# EAGLE design RFID (EAGLE 7.1.0)
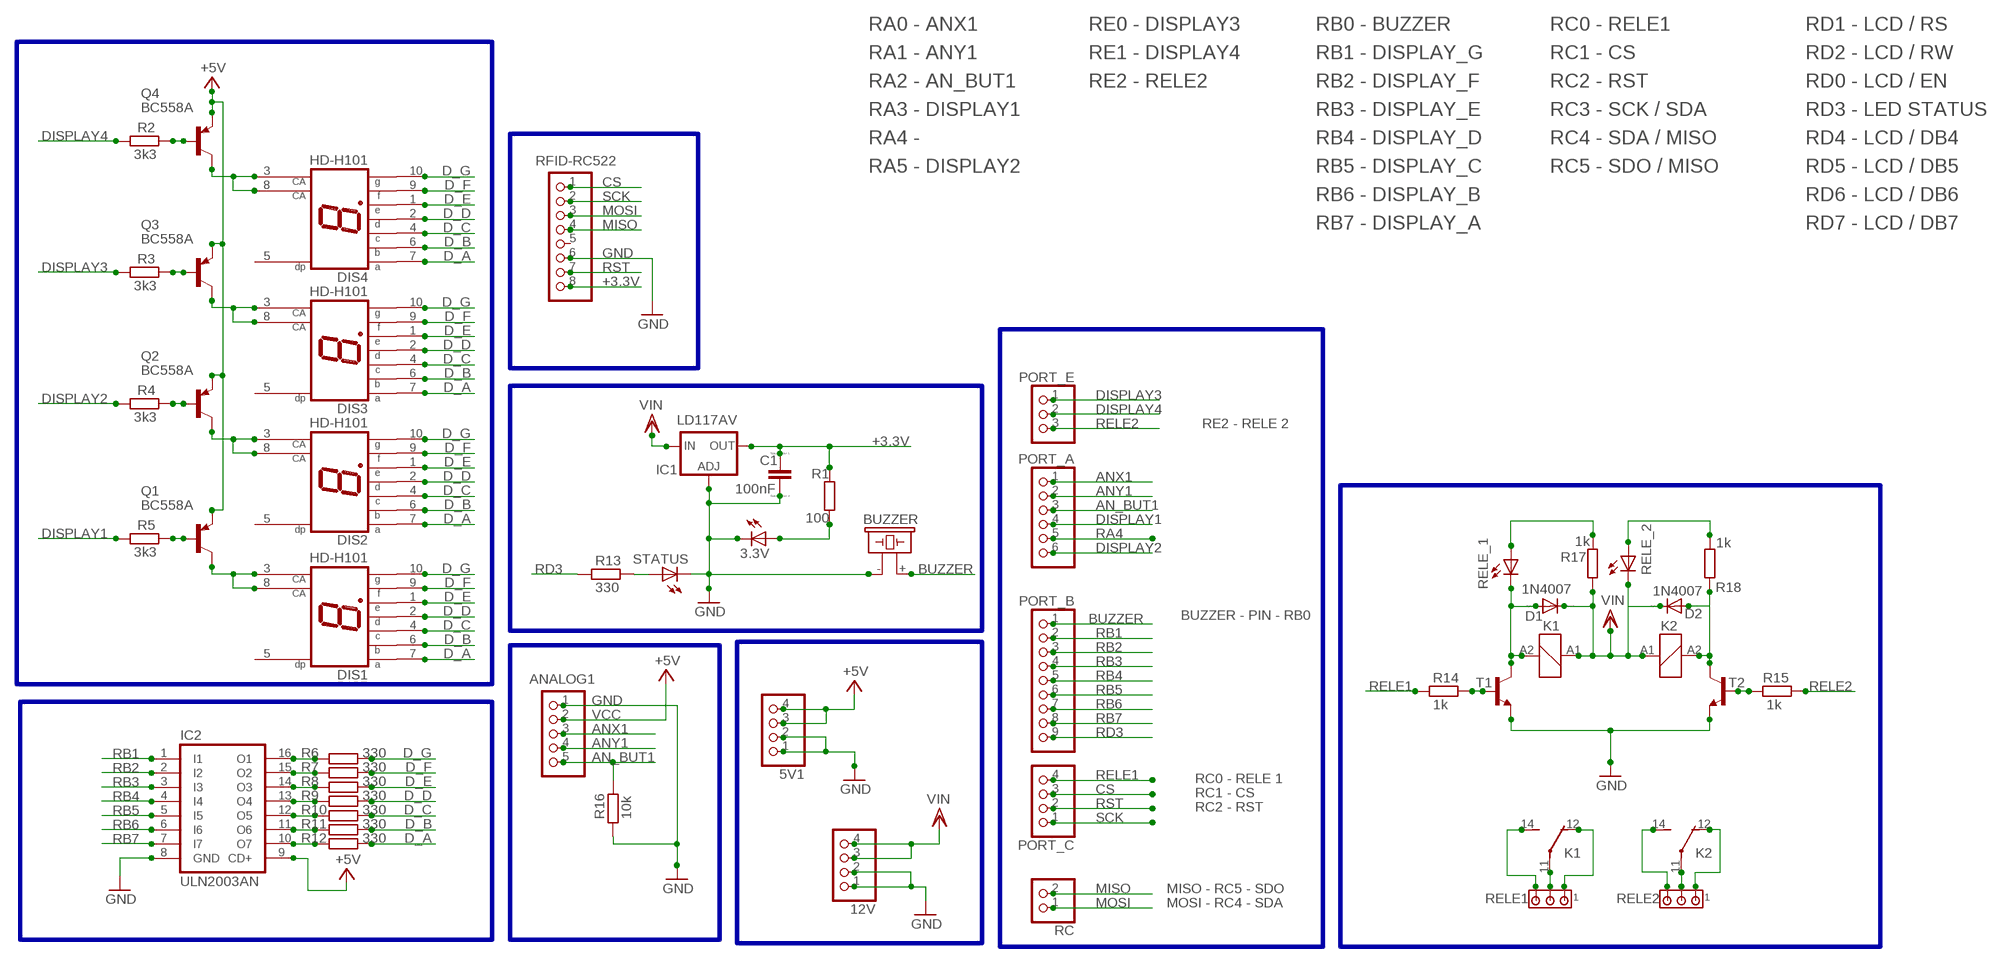
[diagram p0: schematic, sheet 1]

## Parts
3.3V  LED5MM  [LED5MM]
5V  BUZZER  F/CM12P  [F/CM12P]
5V1  PINHD-1X4  [1X04]
12V  PINHD-1X4  [1X04]
ANALOG1  PINHD-1X5  [1X05]
C1  100nF  C-EU050-025X075  [C050-025X075]
D1  1N4007  1N4004  [DO41-10]
D2  1N4007  1N4004  [DO41-10]
DIS1  HD-H101  [HDSP-M]
DIS2  HD-H101  [HDSP-M]
DIS3  HD-H101  [HDSP-M]
DIS4  HD-H101  [HDSP-M]
IC1  LD117AV  [TO220L1]
IC2  ULN2003AN  [DIL16]
JP1  RFID-RC522  PINHD-1X8  [1X08]
K1  ZNS5106  [ZN5]
K2  ZNS5106  [ZN5]
PORT_A  PINHD-1X6  [1X06]
PORT_B  PINHD-1X9  [1X09]
PORT_C  PINHD-1X4  [1X04]
PORT_E  PINHD-1X3  [1X03]
Q1  BC558A  [TO92-EBC]
Q2  BC558A  [TO92-EBC]
Q3  BC558A  [TO92-EBC]
Q4  BC558A  [TO92-EBC]
R1  100  R-EU_0207/10  [0207/10]
R2  3k3  R-EU_0207/10  [0207/10]
R3  3k3  R-EU_0207/10  [0207/10]
R4  3k3  R-EU_0207/10  [0207/10]
R5  3k3  R-EU_0207/10  [0207/10]
R6  330  R-EU_0207/10  [0207/10]
R7  330  R-EU_0207/10  [0207/10]
R8  330  R-EU_0207/10  [0207/10]
R9  330  R-EU_0207/10  [0207/10]
R10  330  R-EU_0207/10  [0207/10]
R11  330  R-EU_0207/10  [0207/10]
R12  330  R-EU_0207/10  [0207/10]
R13  330  R-EU_0207/10  [0207/10]
R14  1k  R-EU_0207/10  [0207/10]
R15  1k  R-EU_0207/10  [0207/10]
R16  10k  R-EU_0207/10  [0207/10]
R17  1k  R-EU_0207/10  [0207/10]
R18  1k  R-EU_0207/10  [0207/10]
RC  PINHD-1X2  [1X02]
RELE1  MTA03-156  [1X3MTA]
RELE2  MTA03-156  [1X3MTA]
RELE_1  LED5MM  [LED5MM]
RELE_2  LED5MM  [LED5MM]
STATUS  LED5MM  [LED5MM]
T1  BC548-NPN-TO92-CBE  [TO92-CBE]
T2  BC548-NPN-TO92-CBE  [TO92-CBE]

## Nets
+3.3V: C1.1 IC1.2(OUT) JP1.8 R1.2
AN_BUT1: ANALOG1.5 PORT_A.3 R16.1
ANX1: ANALOG1.3 PORT_A.1
ANY1: ANALOG1.4 PORT_A.2
BUZZER: 5V.+ PORT_B.1
CS: JP1.1 PORT_C.3
D_A: DIS1.7(A) DIS2.7(A) DIS3.7(A) DIS4.7(A) R12.1
D_B: DIS1.6(B) DIS2.6(B) DIS3.6(B) DIS4.6(B) R11.1
D_C: DIS1.4(C) DIS2.4(C) DIS3.4(C) DIS4.4(C) R10.1
D_D: DIS1.2(D) DIS2.2(D) DIS3.2(D) DIS4.2(D) R9.1
D_E: DIS1.1(E) DIS2.1(E) DIS3.1(E) DIS4.1(E) R8.1
D_F: DIS1.9(F) DIS2.9(F) DIS3.9(F) DIS4.9(F) R7.1
D_G: DIS1.10(G) DIS2.10(G) DIS3.10(G) DIS4.10(G) R6.1
DISPLAY1: PORT_A.4 R5.2
DISPLAY2: PORT_A.6 R4.2
DISPLAY3: PORT_E.1 R3.2
DISPLAY4: PORT_E.2 R2.2
GND: 3.3V.K(C) 5V1.1 5V1.2 5V.- 12V.1 12V.2 ANALOG1.1 C1.2 IC1.1(ADJ) IC2.8(GND) JP1.6 R16.2 STATUS.K(C) T1.E T2.E
MISO: JP1.4 RC.2
MOSI: JP1.3 RC.1
N$1: 3.3V.A R1.1
N$2: DIS4.3(CA) DIS4.8(CA) Q4.C
N$3: Q1.B R5.1
N$4: Q2.B R4.1
N$5: Q3.B R3.1
N$6: Q4.B R2.1
N$7: IC2.16(O1) R6.2
N$8: IC2.15(O2) R7.2
N$9: IC2.14(O3) R8.2
N$10: IC2.13(O4) R9.2
N$11: IC2.12(O5) R10.2
N$12: IC2.11(O6) R11.2
N$13: IC2.10(O7) R12.2
N$14: D2.A K2.A2 R18.2 T2.C
N$15: R13.1 STATUS.A
N$16: D1.A K1.A2 RELE_1.K(C) T1.C
N$17: R14.1 T1.B
N$18: K1.11(2:P) RELE1.2
N$19: R15.2 T2.B
N$20: K1.12(2:O) RELE1.1
N$21: K1.14(2:S) RELE1.3
N$22: K2.11(2:P) RELE2.2
N$23: K2.14(2:S) RELE2.3
N$24: K2.12(2:O) RELE2.1
N$25: R17.2 RELE_1.A
N$26: R18.1 RELE_2.A
RA4: PORT_A.5
RB1: IC2.1(I1) PORT_B.2
RB2: IC2.2(I2) PORT_B.3
RB3: IC2.3(I3) PORT_B.4
RB4: IC2.4(I4) PORT_B.5
RB5: IC2.5(I5) PORT_B.6
RB6: IC2.6(I6) PORT_B.7
RB7: IC2.7(I7) PORT_B.8
RD3: PORT_B.9 R13.2
RELE1: PORT_C.4 R14.2
RELE2: PORT_E.3 R15.1
RST: JP1.7 PORT_C.2
SCK: JP1.2 PORT_C.1
VCC: 5V1.3 5V1.4 ANALOG1.2 IC2.9(CD+) Q1.E Q2.E Q3.E Q4.E ; supply symbol labelled +5V
VCC1: DIS3.3(CA) DIS3.8(CA) Q3.C
VCC2: DIS2.3(CA) DIS2.8(CA) Q2.C
VCC3: DIS1.3(CA) DIS1.8(CA) Q1.C
VDD: 12V.3 12V.4 D1.C D2.C IC1.3(IN) K1.A1 K2.A1 R17.1 RELE_2.K(C) ; supply symbol labelled VIN
Unconnected: DIS1.5(DP) DIS2.5(DP) DIS3.5(DP) DIS4.5(DP) JP1.5

## Buses
B$1
B$2
B$3
B$4
B$5
B$6
B$7
B$8

## Notes on the sheet
- RA0 - ANX1 | RE0 - DISPLAY3 | RB0 - BUZZER | RC0 - RELE1 | RD1 - LCD / RS
- RA1 - ANY1 | RE1 - DISPLAY4 | RB1 - DISPLAY_G | RC1 - CS | RD2 - LCD / RW
- RA2 - AN_BUT1 | RE2 - RELE2 | RB2 - DISPLAY_F | RC2 - RST | RD0 - LCD / EN
- RA3 - DISPLAY1 | RB3 - DISPLAY_E | RC3 - SCK / SDA | RD3 - LED STATUS
- RA4 - | RB4 - DISPLAY_D | RC4 - SDA / MISO | RD4 - LCD / DB4
- RA5 - DISPLAY2 | RB5 - DISPLAY_C | RC5 - SDO / MISO | RD5 - LCD / DB5
- RB6 - DISPLAY_B | RD6 - LCD / DB6
- RB7 - DISPLAY_A | RD7 - LCD / DB7
- RE2 - RELE 2
- BUZZER - PIN - RB0
- RC0 - RELE 1
- RC1 - CS
- RC2 - RST
- MISO - RC5 - SDO
- MOSI - RC4 - SDA

## Library data of the parts
3.3V RELE_1 RELE_2 STATUS = led:LED: LED OSRAM: - CHIPLED LG R971, LG N971, LY N971, LG Q971, LY Q971, LO R971, LY R971 LH N974, LH R974 LS Q976, LO Q976, LY Q976 LO Q996 - Hyper CHIPLED LW Q18S LB Q993, LB Q99A, LB R99A - SideLED LS A670, LO A670, LY A670, LG A670, LP A670 LB A673, LV A673, LT A673, LW A673 LH A674 LY A675 LS A676, LA A676, LO A676, LY A676, LW A676 LS A679, LY A679, LG A679 - Hyper Micro SIDELED® LS Y876, LA Y876, LO Y876, LY Y876 LT Y87S - SmartLED LW L88C, LW L88S LB L89C, LB L89S, LG L890 LS L89K, LO L89K, LY L89K LS L896, LA L896, LO L896, LY L896 - TOPLED LS T670, LO T670, LY T670, LG T670, LP T670 LSG T670, LSP T670, LSY T670, LOP T670, LYG T670 LG T671, LOG T671, LSG T671 LB T673, LV T673, LT T673, LW T673 LH T674 LS T676, LA T676, LO T676, LY T676, LB T676, LH T676, LSB T676, LW T676 LB T67C, LV T67C, LT T67C, LS T67K, LO T67K, LY T67K, LW E67C LS E67B, LA E67B, LO E67B, LY E67B, LB E67C, LV E67C, LT E67C LW T67C LS T679, LY T679, LG T679 LS T770, LO T770, LY T770, LG T770, LP T770 LB T773, LV T773, LT T773, LW T773 LH T774 LS E675, LA E675, LY E675, LS T675 LS T776, LA T776, LO T776, LY T776, LB T776 LHGB T686 LT T68C, LB T68C - Hyper Mini TOPLED® LB M676 - Mini TOPLED Santana® LG M470 LS M47K, LO M47K, LY M47K Source: http://www.osram.convergy.de LUXEON: - LUMILED® LXK2-PW12-R00, LXK2-PW12-S00, LXK2-PW14-U00, LXK2-PW14-V00 LXK2-PM12-R00, LXK2-PM12-S00, LXK2-PM14-U00 LXK2-PE12-Q00, LXK2-PE12-R00, LXK2-PE12-S00, LXK2-PE14-T00, LXK2-PE14-U00 LXK2-PB12-K00, LXK2-PB12-L00, LXK2-PB12-M00, LXK2-PB14-N00, LXK2-PB14-P00, LXK2-PB14-Q00 LXK2-PR12-L00, LXK2-PR12-M00, LXK2-PR14-Q00, LXK2-PR14-R00 LXK2-PD12-Q00, LXK2-PD12-R00, LXK2-PD12-S00 LXK2-PH12-R00, LXK2-PH12-S00 LXK2-PL12-P00, LXK2-PL12-Q00, LXK2-PL12-R00 Source: www.luxeon.com KINGBRIGHT: KA-3528ASYC Source: www.kingbright.com
5V = buzzer:F/CM12P: BUZZER Source: Buerklin; OC_FARNELL: unknown; OC_NEWARK: unknown
5V1 12V PORT_C = pinhead:PINHD-1X4: PIN HEADER
ANALOG1 = pinhead:PINHD-1X5: PIN HEADER
C1 = resistor:C-EU: CAPACITOR, European symbol; SPICEPREFIX: C
D1 D2 = diode:1N4004: DIODE general purpose rectifier, 1 A
DIS1-DIS4 = display-hp:HD-H101: LED DISPLAY 1-character 7 segment, decimal point right; OC_FARNELL: unknown; OC_NEWARK: unknown
IC1 = v-reg:LD117A?*: Low drop fixed and adjustable positive voltage regulators 1 A Source: http://www.st.com/stonline/products/literature/ds/7194/ld1117axx.pdf
IC2 = uln-udn:ULN2003A: DRIVER ARRAY
JP1 = pinhead:PINHD-1X8: PIN HEADER
K1 K2 = relay:ZNS5*: Miniature Power PCB Relay SCHRACK 1pole 10 A Source: http://www.schrack.com/.. 5847.pdf; OC_FARNELL: unknown; OC_NEWARK: unknown
PORT_A = pinhead:PINHD-1X6: PIN HEADER
PORT_B = pinhead:PINHD-1X9: PIN HEADER
PORT_E = pinhead:PINHD-1X3: PIN HEADER
Q1-Q4 = transistor-pnp:BC558*: PNP Transistror
R1-R18 = rcl:R-EU_: RESISTOR, European symbol
RC = pinhead:PINHD-1X2: PIN HEADER
RELE1 RELE2 = con-amp:MTA03-156: AMP connector
T1 T2 = transistor:*-NPN-: NPN Transistror BF959 corrected 2008.03.06

## Board
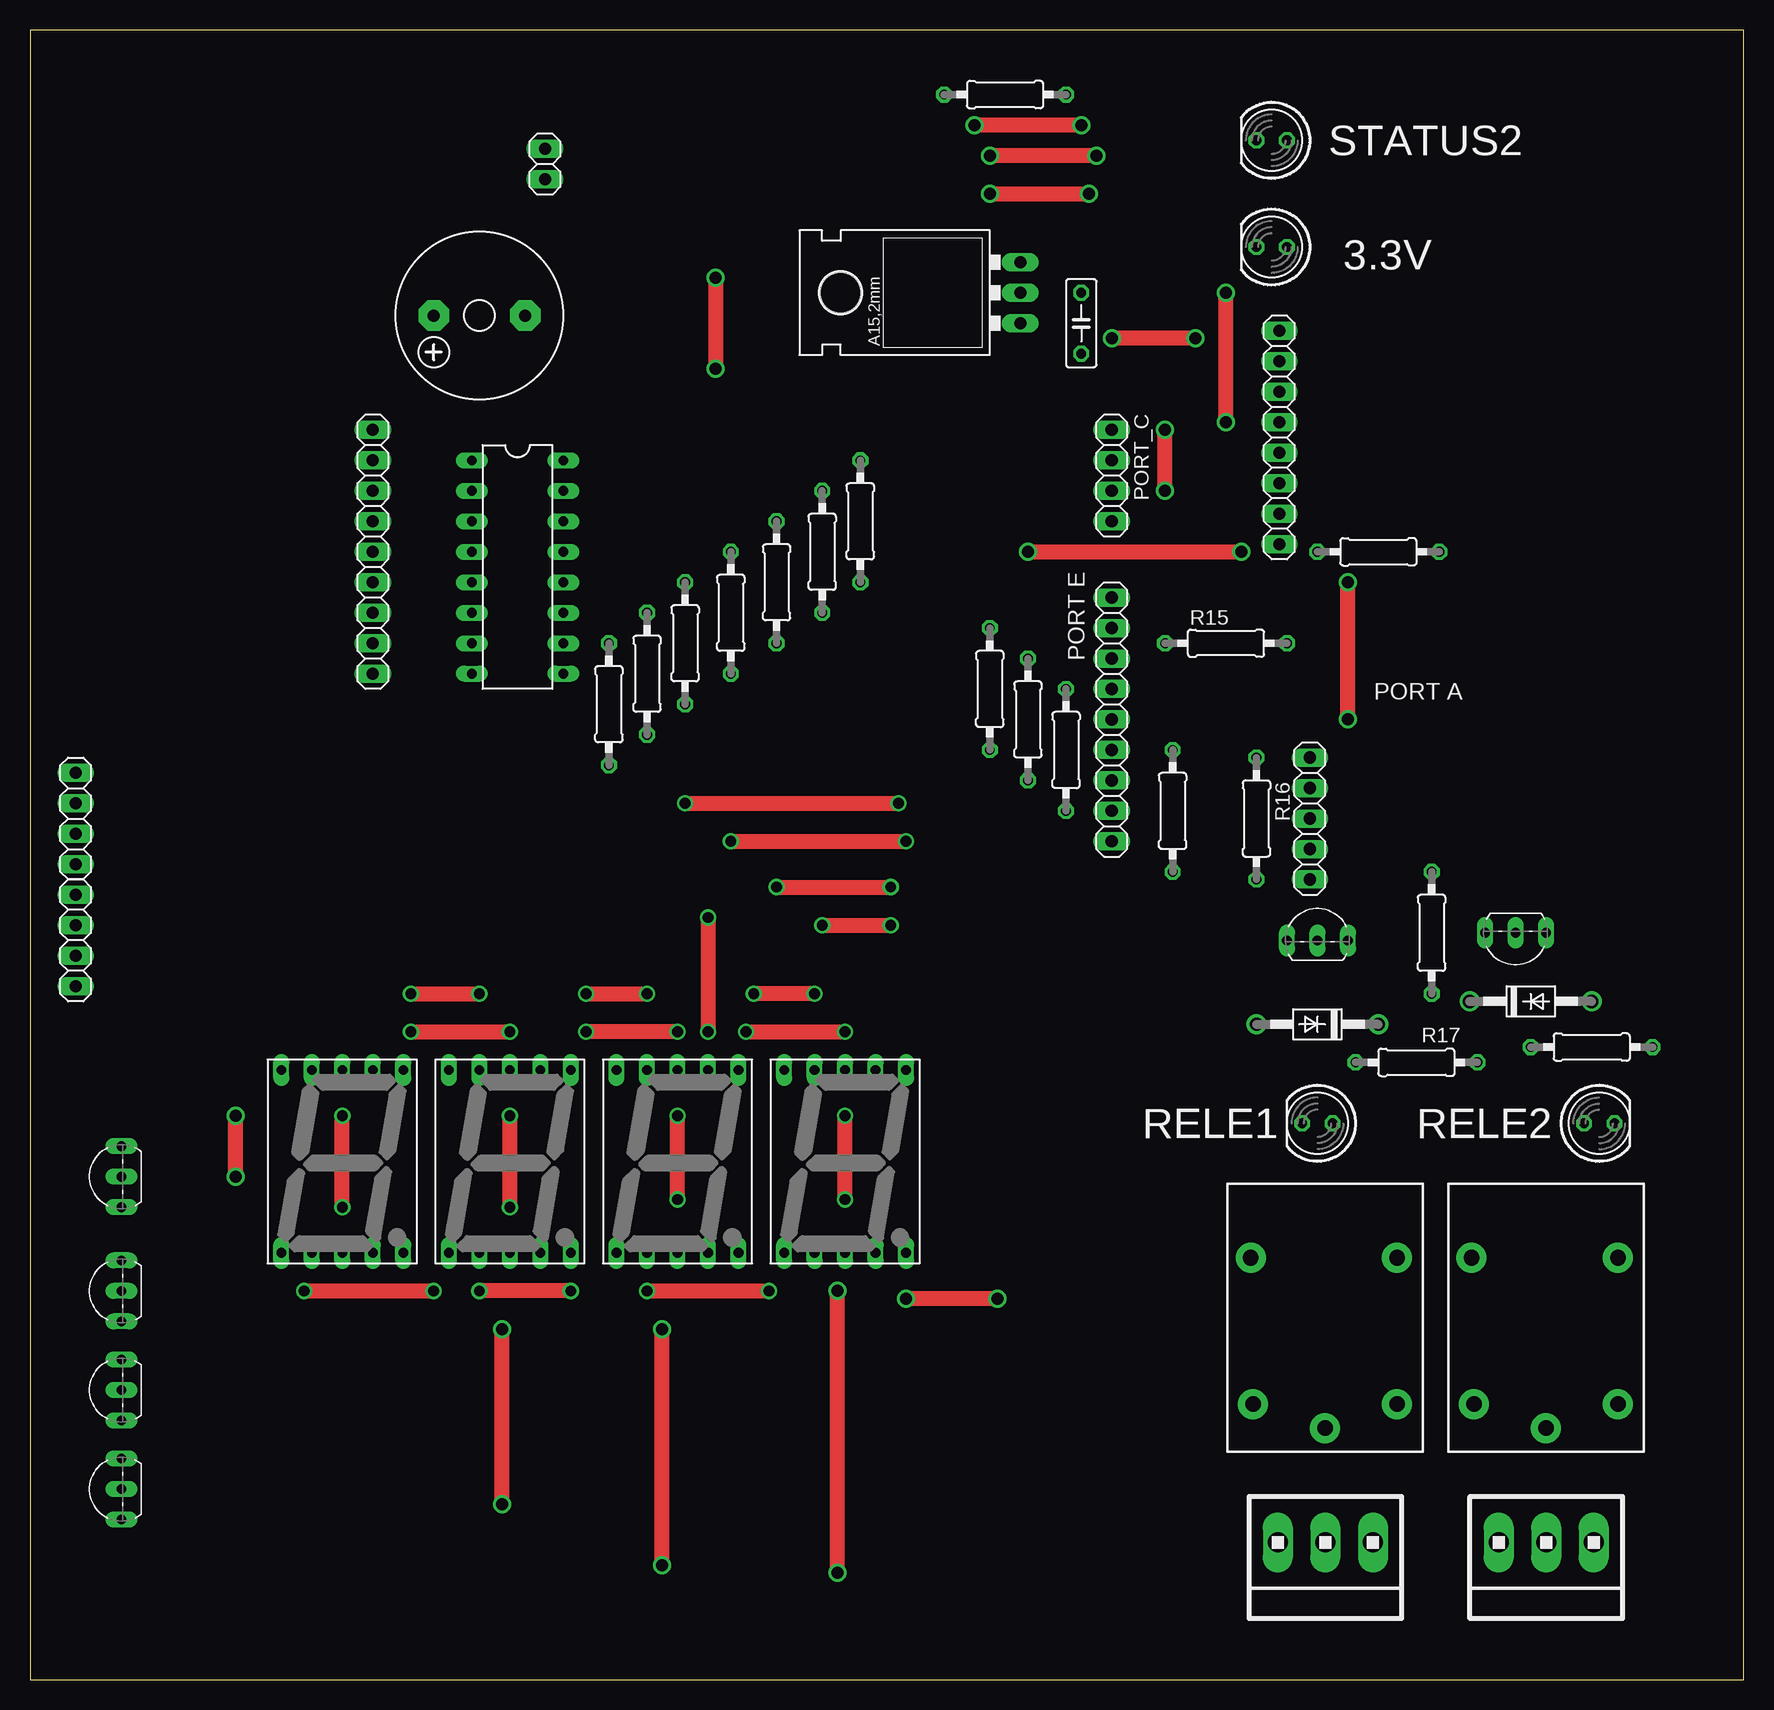
[diagram p1: board, top side]
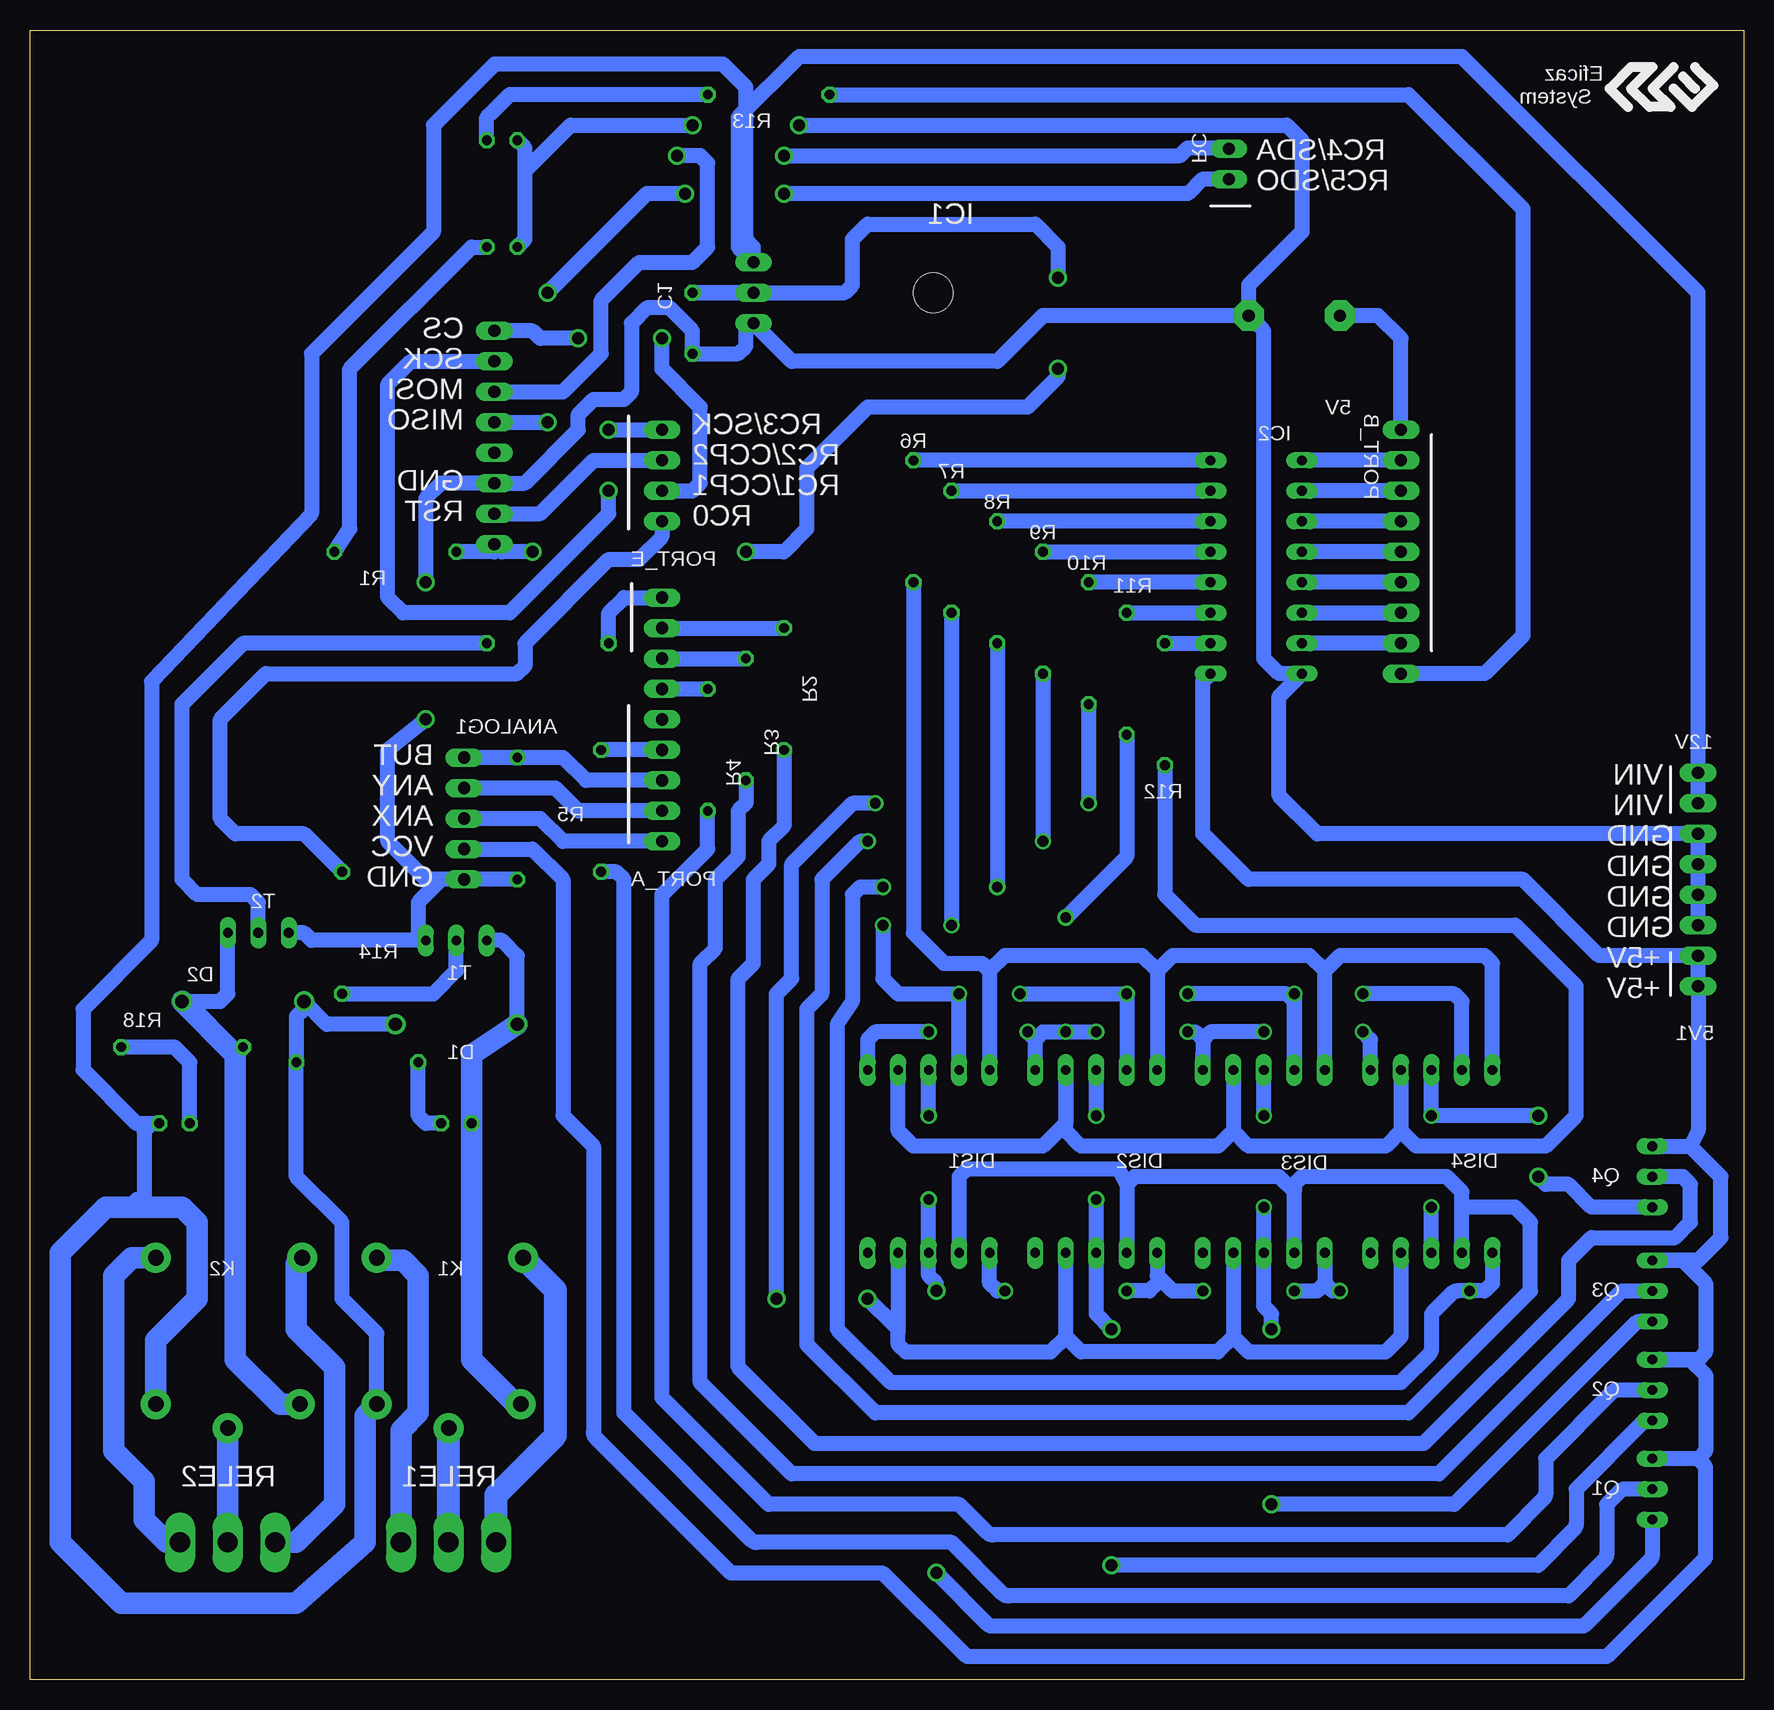
[diagram p2: board, bottom side, seen from below]

Size 142.85 x 137.47 mm. Coordinates in mm from the lower left corner, seen from the top.
Outline: 0,0 142.85,0 142.85,137.47 0,137.47 0,0
Copper layers (1*16): Top 0.035mm / dielectric 1.5mm / Bottom 0.035mm
Design rules "default": minimum track width 10mil, minimum drill 24mil, track to track 8mil, track to pad 8mil, pad to pad 8mil, via to via 8mil, smd to smd 8mil, copper to edge 40mil, drill to drill 8mil, minimum pad ring 10mil, minimum via ring 8mil, stop-mask expansion 4mil, vias tented up to drill 0mil, thermal gap 10mil

### Footprints (pad centres in the part's own frame; a part is rotated, then mirrored left to right if it is on the bottom)
LED5MM = drill 0.813 octagon: A -1.27,0; K 1.27,0
F/CM12P = drill 1.016 pad 2.54 octagon: + 3.81,0; - -3.81,0
1X04 = drill 1.016 long: 1 -3.81,0; 2 -1.27,0; 3 1.27,0; 4 3.81,0
1X05 = drill 1.016 long: 1 -5.08,0; 2 -2.54,0; 3 0,0; 4 2.54,0; 5 5.08,0
C050-025X075 = drill 0.813 octagon: 1 -2.54,0; 2 2.54,0
DO41-10 = drill 1.118: A 5.08,0; C -5.08,0
HDSP-M = drill 0.813 long: 1 -5.08,-7.62; 2 -2.54,-7.62; 3 0,-7.62; 4 2.54,-7.62; 5 5.08,-7.62; 6 5.08,7.62; 7 2.54,7.62; 8 0,7.62; 9 -2.54,7.62; 10 -5.08,7.62
TO220L1 = drill 1.016 long: 1 -2.54,-3.81; 2 0,-3.81; 3 2.54,-3.81 | hole 3.302: 0,11.176
DIL16 = drill 0.813 long: 1 -8.89,-3.81; 2 -6.35,-3.81; 3 -3.81,-3.81; 4 -1.27,-3.81; 5 1.27,-3.81; 6 3.81,-3.81; 7 6.35,-3.81; 8 8.89,-3.81; 9 8.89,3.81; 10 6.35,3.81; 11 3.81,3.81; 12 1.27,3.81; 13 -1.27,3.81; 14 -3.81,3.81; 15 -6.35,3.81; 16 -8.89,3.81
1X08 = drill 1.016 long: 1 -8.89,0; 2 -6.35,0; 3 -3.81,0; 4 -1.27,0; 5 1.27,0; 6 3.81,0; 7 6.35,0; 8 8.89,0
ZN5 = drill 1.3 pad 2.5: 11 8.89,0; 12 -5.31,-6.2; 14 -5.31,6; A1 6.89,6; A2 6.89,-6
1X06 = drill 1.016 long: 1 -6.35,0; 2 -3.81,0; 3 -1.27,0; 4 1.27,0; 5 3.81,0; 6 6.35,0
1X09 = drill 1.016 long: 1 -10.16,0; 2 -7.62,0; 3 -5.08,0; 4 -2.54,0; 5 0,0; 6 2.54,0; 7 5.08,0; 8 7.62,0; 9 10.16,0
1X03 = drill 1.016 long: 1 -2.54,0; 2 0,0; 3 2.54,0
TO92-EBC = drill 0.813 long: B 0,-1.27; C -2.54,-1.27; E 2.54,-1.27
0207/10 = drill 0.813 octagon: 1 -5.08,0; 2 5.08,0
1X02 = drill 1.016 long: 1 -1.27,0; 2 1.27,0
1X3MTA = drill 1.676 long: 1 3.937,0; 2 -0.025,0; 3 -3.988,0
TO92-CBE = drill 0.813 long: B 0,0; C -2.54,0; E 2.54,0

### Placement (x,y rotation side)
3.3V  103.5,119.38 180 top
5V  37.47,113.67 180 top
5V1  3.81,61.59 270 top
12V  3.81,71.75 90 top
ANALOG1  106.68,71.75 90 top
C1  87.63,113.03 270 top
D1  107.31,54.61 180 top
D2  125.09,56.52 0 top
DIS1  67.94,43.18 0 top
DIS2  53.98,43.18 0 top
DIS3  40.01,43.18 0 top
DIS4  26.04,43.18 0 top
IC1  78.74,115.57 90 top
IC2  40.64,92.71 270 top
JP1  104.14,103.51 270 top
K1  107.95,29.85 270 top
K2  126.36,29.85 270 top
PORT_A  90.17,76.2 90 top
PORT_B  28.57,93.98 270 top
PORT_C  90.17,100.33 270 top
PORT_E  90.17,87.63 90 top
Q1  6.35,15.88 90 top
Q2  6.35,24.13 90 top
Q3  6.35,32.39 90 top
Q4  6.35,41.91 90 top
R1  112.39,93.98 180 top
R2  80.01,82.55 90 top
R3  83.19,80.01 90 top
R4  86.36,77.47 90 top
R5  95.25,72.39 90 top
R6  69.22,96.52 90 top
R7  66.04,93.98 90 top
R8  62.23,91.44 90 top
R9  58.42,88.9 90 top
R10  54.61,86.36 90 top
R11  51.44,83.82 90 top
R12  48.26,81.28 90 top
R13  81.28,132.08 180 top
R14  116.84,62.23 90 top
R15  99.69,86.36 0 top
R16  102.23,71.75 270 top
R17  115.57,51.44 180 top
R18  130.18,52.71 180 top
RC  42.93,126.29 270 top
RELE1  107.95,11.43 180 top
RELE2  126.36,11.43 180 top
RELE_1  107.31,46.36 180 top
RELE_2  130.81,46.36 0 top
STATUS  103.5,128.27 180 top
T1  107.31,61.59 0 top
T2  123.83,62.23 180 top

### Tracks (layer width: path | path; a pad name or v marks a point on that pad's centre or on a via)
+3.3V  (via drill 1)
  Top 1.27: v57.15,116.84 v57.15,109.22 | v83.19,93.98 v100.97,93.98
  Bottom 1.27: IC1.2 C1.1 74.93,115.57 74.3,116.2 74.3,120.02 73.03,121.28 59.05,121.28 57.15,119.38 v57.15,116.84 | v57.15,109.22 57.15,108.59 59.69,106.05 73.03,106.05 78.11,100.97 78.11,95.89 80.01,93.98 v83.19,93.98 | v100.97,93.98 103.5,93.98 JP1.8 104.14,93.98 R1.2
AN_BUT1
  Bottom 1.27: PORT_A.3 96.52,74.93 98.42,76.84 ANALOG1.5 R16.1
ANX1
  Bottom 1.27: PORT_A.1 98.42,69.85 100.33,71.75 ANALOG1.3
ANY1
  Bottom 1.27: PORT_A.2 97.16,72.39 99.06,74.3 ANALOG1.4
BUZZER
  Bottom 1.27: PORT_B.1 28.57,111.76 30.48,113.67 5V.+
CS  (via drill 1)
  Top 1.27: v97.16,111.76 v90.17,111.76
  Bottom 1.27: v97.16,111.76 100.33,111.76 100.97,112.4 JP1.1 104.78,112.4 | PORT_C.3 87.63,99.06 87,99.69 87,106.05 90.17,109.22 v90.17,111.76
D_A
  Bottom 1.27: DIS4.7 28.57,45.72 | 28.57,45.72 29.84,44.45 41.27,44.45 42.55,45.72 | DIS3.7 42.55,45.72 | 42.55,45.72 43.81,44.45 55.24,44.45 56.52,45.72 DIS2.7 56.52,46.36 58.42,44.45 69.22,44.45 70.48,45.72 DIS1.7 | R12.1 48.26,65.41 45.72,62.87 19.05,62.87 13.97,57.79 13.97,46.99 16.51,44.45 27.3,44.45 28.57,45.72
D_B  (via drill 0.9)
  Top 1.27: v31.75,53.98 v40.01,53.98 | v53.98,53.98 v46.35,53.98 | v59.69,53.98 v67.94,53.98 | v56.52,63.5 v56.52,53.98
  Bottom 1.27: 45.09,52.07 DIS3.6 45.09,53.34 | DIS4.6 31.11,53.34 v31.75,53.98 | v40.01,53.98 44.45,53.98 45.09,53.34 | DIS2.6 59.05,53.34 | v53.98,53.98 v56.52,53.98 58.42,53.98 59.05,53.34 | v46.35,53.98 45.72,53.98 45.09,53.34 | 59.05,53.34 v59.69,53.98 | v67.94,53.98 72.39,53.98 73.03,53.34 DIS1.6 | R11.1 51.44,68.58 v56.52,63.5
D_C  (via drill 0.9, 1)
  Top 1.27: v54.61,73.03 v72.39,73.03 | v80.64,31.75 v73.03,31.75
  Bottom 1.27: DIS4.4 28.57,28.58 29.84,27.31 41.27,27.31 42.55,28.58 | DIS3.4 42.55,28.58 | 42.55,28.58 43.81,27.31 55.24,27.31 56.52,28.58 | 56.52,28.58 DIS2.4 | DIS1.4 70.48,28.95 | 56.52,28.58 57.78,27.31 69.85,27.31 70.48,27.94 70.48,28.95 | R10.1 v54.61,73.03 | v72.39,73.03 74.3,73.03 79.38,67.95 79.38,58.42 80.64,57.15 v80.64,31.75 | 70.48,28.95 arc-45 70.67,29.4 v73.03,31.75
D_D  (via drill 0.9)
  Top 1.27: v58.42,69.85 v73.03,69.85
  Bottom 1.27: DIS4.2 23.5,39.37 | 23.5,39.37 23.5,40.64 24.77,41.91 36.83,41.91 37.47,41.28 37.47,40.64 | DIS3.2 37.47,40.64 | 37.47,40.64 38.73,41.91 50.8,41.91 51.44,41.28 | 51.44,41.28 DIS2.2 | 51.44,41.28 52.07,42.55 64.77,42.55 65.41,41.91 DIS1.2 | R9.1 v58.42,69.85 | v73.03,69.85 73.66,69.85 76.83,66.68 76.83,57.15 78.11,55.88 78.11,27.94 72.39,22.23 27.94,22.23 17.78,32.39 17.78,38.1 19.05,39.37 23.5,39.37
D_E  (via drill 0.9)
  Top 1.27: v22.86,32.39 v33.66,32.39 | v45.09,32.39 v37.47,32.39 | v51.44,32.39 v61.59,32.39 | v62.23,66.04 v71.75,66.04
  Bottom 1.27: DIS4.1 20.95,33.02 21.59,32.39 v22.86,32.39 23.87,32.39 arc-45 24.32,32.2 26.04,30.48 26.04,27.57 arc45 26.22,27.12 28.57,24.77 71.12,24.77 75.56,29.21 75.56,54.61 74.3,56.52 74.3,65.41 73.66,66.04 v71.75,66.04 | v33.66,32.39 34.29,32.39 34.92,33.02 | DIS3.1 34.92,33.02 | 34.92,33.02 35.56,32.39 v37.47,32.39 | v45.09,32.39 47.62,32.39 48.9,33.66 DIS2.1 48.9,33.02 49.53,32.39 v51.44,32.39 | v61.59,32.39 62.23,32.39 62.87,33.02 DIS1.1 | R8.1 v62.23,66.04
D_F  (via drill 0.9)
  Top 1.27: v31.75,57.15 v37.47,57.15 | v46.35,57.15 v51.44,57.15 | v65.41,57.15 v60.33,57.15 | v66.04,62.87 v71.75,62.87
  Bottom 1.27: DIS4.9 23.5,56.52 24.13,57.15 v31.75,57.15 | v37.47,57.15 DIS3.9 37.47,56.52 38.1,57.15 v46.35,57.15 | DIS2.9 v51.44,57.15 v60.33,57.15 | DIS1.9 v65.41,57.15 70.48,57.15 71.75,58.42 v71.75,62.87 | R7.1 v66.04,62.87
D_G
  Bottom 1.27: DIS4.10 20.95,59.69 21.59,60.33 33.66,60.33 34.92,59.06 | DIS3.10 34.92,59.06 | 34.92,59.06 36.2,60.33 47.62,60.33 48.9,59.06 | 48.9,59.06 DIS2.10 | 48.9,59.06 50.16,60.33 61.59,60.33 62.87,59.06 | 62.87,59.06 DIS1.10 | R6.1 69.22,62.23 66.67,59.69 63.5,59.69 62.87,59.06
DISPLAY1
  Bottom 1.27: PORT_A.4 R5.2
DISPLAY2
  Bottom 1.27: PORT_A.6 R4.2
DISPLAY3
  Bottom 1.27: PORT_E.1 R3.2
DISPLAY4
  Bottom 1.27: PORT_E.2 R2.2
GND  (via drill 1)
  Top 1.27: v87.63,129.54 v78.74,129.54 | v109.86,80.01 v109.86,91.44
  Bottom 1.27: 5V.- 40.01,112.4 40.01,85.09 38.73,83.82 IC2.8 38.73,81.92 38.73,73.66 35.56,70.49 12V.2 12V.1 5V1.1 5V1.2 | R16.2 ANALOG1.1 | ANALOG1.1 108.58,66.68 110.49,64.77 110.49,62.23 T1.E 119.38,61.59 120.02,62.23 T2.E | 3.3V.K 101.6,120.02 101.6,125.73 | 101.6,125.73 101.6,127.64 STATUS.K | 5V.- 58.42,113.67 62.23,109.86 79.38,109.86 IC1.1 83.19,112.4 83.19,111.12 83.82,110.49 C1.2 87.63,112.4 89.53,114.3 91.44,114.3 92.71,113.03 92.71,107.31 93.34,106.68 95.89,106.68 97.16,105.41 97.16,104.14 101.6,99.69 JP1.6 108.58,99.69 109.86,98.43 v109.86,91.44 | 101.6,125.73 97.79,129.54 v87.63,129.54 | v78.74,129.54 38.1,129.54 36.83,128.27 36.83,120.65 41.27,116.2 5V.- | ANALOG1.1 109.86,66.68 113.03,69.85 113.03,77.47 v109.86,80.01
MISO  (via drill 1)
  Top 1.27: v80.01,123.83 v88.27,123.83 | v99.69,104.78 v99.69,115.57
  Bottom 1.27: RC.2 45.16,125.02 46.35,123.83 v80.01,123.83 | v88.27,123.83 91.44,123.83 v99.69,115.57 | JP1.4 v99.69,104.78
MOSI  (via drill 1)
  Top 1.27: v88.9,127 v80.01,127
  Bottom 1.27: JP1.3 98.42,107.31 95.25,110.49 95.25,114.94 92.08,118.11 87.63,118.11 86.36,119.38 86.36,126.37 87,127 v88.9,127 | v80.01,127 46.99,127 46.35,127.64 43,127.64 RC.1
N$1
  Bottom 1.27: 3.3V.A 106.05,119.38 116.2,109.22 116.2,95.89 R1.1
N$2  (via drill 0.9, 1)
  Top 1.27: v26.04,39.37 v26.04,46.99 | v17.14,41.91 v17.14,46.99
  Bottom 1.27: DIS4.3 v26.04,39.37 | DIS4.8 v26.04,46.99 v17.14,46.99 | Q4.C 12.7,39.37 14.61,41.28 16.51,41.28 v17.14,41.91
N$3
  Bottom 1.27: R5.1 93.98,67.31 93.34,66.68 93.34,22.23 82.74,11.62 arc-45 82.29,11.43 66.04,11.43 61.78,7.17 arc-45 61.33,6.99 14.61,6.99 11.62,9.97 arc-45 11.43,10.42 11.43,14.61 10.35,15.69 arc45 9.9,15.88 Q1.B
N$4
  Bottom 1.27: R4.1 86.36,69.22 90.17,65.41 90.17,23.5 81.28,14.61 65.41,14.61 63.05,12.25 arc-45 62.6,12.07 19.68,12.07 16.7,15.05 arc-45 16.51,15.5 16.51,18.42 10.98,23.94 arc45 10.53,24.13 Q2.B
N$5
  Bottom 1.27: R3.1 83.19,73.03 83.82,72.39 83.82,68.58 85.72,66.68 85.72,60.96 87,59.69 87,24.77 79.38,17.15 25.4,17.15 10.16,32.39 Q3.B
N$6
  Bottom 1.27: R2.1 80.01,71.12 81.28,69.85 81.28,67.95 82.55,66.68 82.55,59.69 83.82,58.42 83.82,26.04 77.47,19.69 26.67,19.69 14.61,31.75 14.61,34.93 12.7,36.83 5.71,36.83 4.45,38.1 4.45,41.28 5.08,41.91 Q4.B
N$7
  Bottom 1.27: IC2.16 R6.2
N$8
  Bottom 1.27: R7.2 IC2.15
N$9
  Bottom 1.27: IC2.14 R8.2
N$10
  Bottom 1.27: R9.2 IC2.13
N$11
  Bottom 1.27: IC2.12 R10.2
N$12
  Bottom 1.27: R11.2 IC2.11
N$13
  Bottom 1.27: R12.2 IC2.10
N$14
  Bottom 1.27: T2.C 126.36,57.15 127,56.52 D2.A | R18.2 125.73,52.07
  Bottom 1.778: K2.A2 122.02,22.96 125.73,26.67 125.73,52.07 D2.A
N$15
  Bottom 1.27: STATUS.A 104.78,130.18 104.46,130.49 104.14,130.81 102.87,132.08 R13.1
N$16
  Bottom 1.27: D1.A 102.23,60.33 103.5,61.59 T1.C
  Bottom 1.778: K1.A2 102.33,22.96 106.05,26.67 RELE_1.K 106.05,49.53 106.05,52.07 D1.A
N$17
  Bottom 1.27: R14.1 109.22,57.15 107.31,59.06 T1.B
N$18
  Bottom 1.93: RELE1.2 107.97,20.93 K1.11
N$19
  Bottom 1.27: T2.B 123.83,64.77 124.46,65.41 128.91,65.41 130.18,66.68 130.18,81.28 125.09,86.36 R15.2
N$20
  Bottom 1.93: RELE1.1 104.01,15.37 99.06,20.32 99.06,32.47 K1.12
N$21
  Bottom 1.778: RELE1.3 111.94,20.78 110.49,22.23 110.49,33.66 111.76,34.93 113.72,34.93 K1.14
N$22
  Bottom 1.778: RELE2.2 126.39,20.93 K2.11
N$23
  Bottom 1.778: RELE2.3 131.44,11.43 133.35,13.34 133.35,16.51 135.89,19.05 135.89,33.66 134.39,35.16 K2.14
N$24
  Bottom 1.778: RELE2.1 120.65,11.43 117.47,14.61 117.47,26.04 120.65,29.21 120.65,34.67 K2.12
N$25
  Bottom 1.27: RELE_1.A 109.86,46.36 110.49,46.99 R17.2
N$26
  Bottom 1.27: RELE_2.A 129.54,51.44 130.81,52.71 R18.1
RB1
  Bottom 1.27: PORT_B.2 IC2.1
RB2
  Bottom 1.27: PORT_B.3 IC2.2
RB3
  Bottom 1.27: PORT_B.4 IC2.3
RB4
  Bottom 1.27: PORT_B.5 IC2.4
RB5
  Bottom 1.27: PORT_B.6 IC2.5
RB6
  Bottom 1.27: IC2.6 PORT_B.7
RB7
  Bottom 1.27: PORT_B.8 IC2.7
RD3
  Bottom 1.27: R13.2 27.94,132.08 18.41,122.56 18.41,87 21.59,83.82 PORT_B.9
RELE1
  Bottom 1.27: R14.2 120.02,70.49 125.73,70.49 127,71.75 127,80.01 123.19,83.82 102.23,83.82 101.6,84.46 101.6,86.36 94.61,93.34 92.08,93.34 90.17,95.25 PORT_C.4
RELE2
  Bottom 1.27: R15.1 94.61,88.9 93.34,90.17 PORT_E.3
RST
  Bottom 1.27: JP1.7 100.33,97.16 95.89,101.6 PORT_C.2
SCK  (via drill 1)
  Top 1.27: v94.61,99.06 v94.61,104.14
  Bottom 1.27: JP1.2 111.12,109.86 113.03,107.95 113.03,90.17 111.76,88.9 102.87,88.9 94.61,97.16 v94.61,99.06 | v94.61,104.14 PORT_C.1
VCC
  Bottom 1.27: 4.45,44.45 3.81,45.72 5V1.4 5V1.3 12.06,60.33 18.41,66.68 41.27,66.68 45.09,70.49 45.09,83.19 IC2.9 | Q4.E 4.45,44.45 | 3.81,18.42 3.17,19.05 3.17,25.4 4.45,26.67 Q2.E 3.81,26.67 3.17,27.31 3.17,33.02 5.08,34.93 Q3.E 3.81,34.93 1.91,36.83 1.91,41.91 4.45,44.45 | 3.81,18.42 Q1.E | ANALOG1.2 100.97,69.22 98.42,66.68 98.42,46.99 95.89,44.45 95.89,20.58 arc-45 95.7,20.13 84.45,8.89 72.02,8.89 arc45 71.57,8.7 64.96,2.09 arc-45 64.51,1.91 11.43,1.91 3.17,10.16 3.17,17.52 arc-45 3.36,17.97 3.81,18.42
VCC1  (via drill 0.9, 1)
  Top 1.27: v40.01,39.37 v40.01,46.99 | v39.37,14.61 v39.37,29.21
  Bottom 1.27: v40.01,39.37 DIS3.3 40.01,31.12 39.37,30.48 v39.37,29.21 | v40.01,46.99 DIS3.8 | Q3.C 8.63,29.85 arc-45 9.08,29.66 24.13,14.61 v39.37,14.61
VCC2  (via drill 0.9, 1)
  Top 1.27: v53.98,40.01 v53.98,46.99 | v52.7,9.53 v52.7,29.21
  Bottom 1.27: v53.98,40.01 53.98,36.2 DIS2.3 53.98,30.48 v52.7,29.21 | v53.98,46.99 DIS2.8 53.98,51.44 | Q2.C 7.99,21.59 arc-45 8.44,21.4 13.97,15.88 13.97,12.96 arc45 14.16,12.51 17.14,9.53 v52.7,9.53
VCC3  (via drill 0.9, 1)
  Top 1.27: v67.94,40.01 v67.94,46.99 | v67.31,8.89 v67.31,32.39
  Bottom 1.27: v67.94,40.01 DIS1.3 67.94,33.66 67.31,33.02 v67.31,32.39 | v67.94,46.99 DIS1.8 | Q1.C 7.62,10.42 arc45 7.81,9.97 13.34,4.45 62.6,4.45 arc45 63.05,4.63 v67.31,8.89
VDD
  Bottom 1.27: 12V.3 12V.4 3.81,115.57 23.5,135.25 78.74,135.25 83.82,130.18 83.82,119.38 IC1.3 82.55,119.38 83.19,120.02 83.19,132.72 85.09,134.62 104.14,134.62 109.22,129.54 109.22,120.65 119.38,110.49 119.38,97.16 132.72,83.19 132.72,61.59 138.43,55.88 138.43,50.8 133.99,46.36 132.72,46.36 | 133.99,40.01 133.67,39.69 | 133.67,39.69 133.35,39.37 | D1.C 118.11,54.61 D2.C 120.02,55.88 120.65,55.25 R17.1 120.65,41.91 116.84,38.1 116.84,31.75 113.95,28.86 K1.A1 | 133.67,39.69 133.35,40.01 133.35,45.72 132.72,46.36 | 132.72,46.36 RELE_2.K
  Bottom 1.778: K2.A1 132.37,28.29 128.91,31.75 128.91,38.1 130.18,39.37 133.35,39.37 136.53,39.37 140.34,35.56 140.34,11.43 135.25,6.35 120.65,6.35 114.94,11.43 114.94,21.97 K1.A1

### Text on the board
tPlace: PORT E | PORT A
tNames: STATUS2 | 3.3V | RELE1 | RELE2
bNames: Eficaz / System | RC4/SDA | RC5/SDO | CS | SCK | MOSI | RC3/SCK | MISO | RC2/CCP2 | RC1/CCP1 | GND | RC0 | RST | VIN | BUT | VIN | ANY | GND | ANX | GND | VCC | GND | GND | GND | +5V | +5V